# Altium project NUCLEOG431RB-Custom-IN-A2212.PrjPcb (part 3 of 3)

## Sheet Hall_Input.SchDoc
size A4
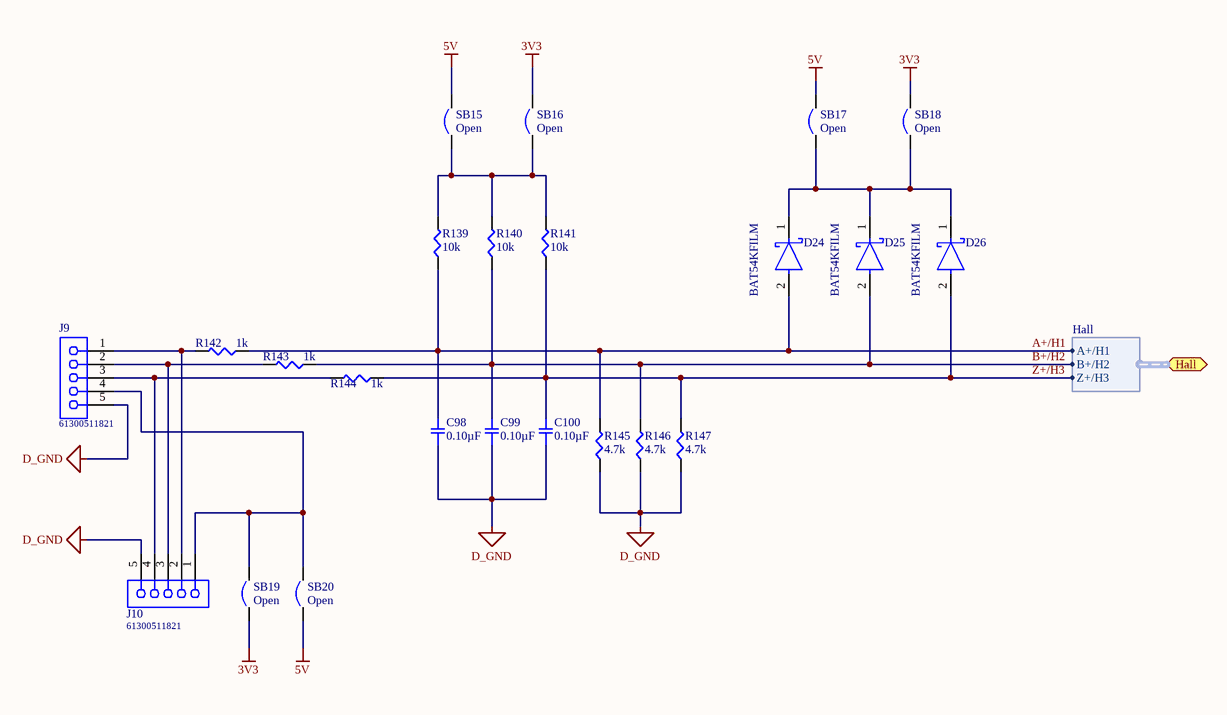
[diagram p8: Hall_Input.SchDoc]

### Parts
C98  0.10µF  [SMD-0805C]
C99  0.10µF  [SMD-0805C]
C100  0.10µF  [SMD-0805C]
D24  BAT54KFILM  [FP-SOD-523-MFG]
D25  BAT54KFILM  [FP-SOD-523-MFG]
D26  BAT54KFILM  [FP-SOD-523-MFG]
J9  61300511821  [61300511821]
J10  61300511821  [61300511821]
R139  10k  [SMD-0603-RES]
R140  10k  [SMD-0603-RES]
R141  10k  [SMD-0603-RES]
R142  1k  [SMD-0603-RES]
R143  1k  [SMD-0603-RES]
R144  1k  [SMD-0603-RES]
R145  4.7k  [SMD-0603-RES]
R146  4.7k  [SMD-0603-RES]
R147  4.7k  [SMD-0603-RES]
SB15  Open  [Solder Bridge - HP - SQ]  (no BOM)
SB16  Open  [Solder Bridge - HP - SQ]  (no BOM)
SB17  Open  [Solder Bridge - HP - SQ]  (no BOM)
SB18  Open  [Solder Bridge - HP - SQ]  (no BOM)
SB19  Open  [Solder Bridge - HP - SQ]  (no BOM)
SB20  Open  [Solder Bridge - HP - SQ]  (no BOM)

### Ports
Hall (bidir, harness Hall)

### Harnesses
Hall: A+/H1, B+/H2, Z+/H3

### Nets
3V3: SB16.2 SB18.2 SB19.1
5V: SB15.2 SB17.2 SB20.1
D_GND: C98.1 C99.1 C100.1 J9.5 J10.5 R145.1 R146.1 R147.1  [project net J2_20]
A+/H1: C98.2 D24.2(A) R139.1 R142.1 R145.2 ; port Hall.A+/H1
B+/H2: C99.2 D25.2(A) R140.1 R143.1 R146.2 ; port Hall.B+/H2
Z+/H3: C100.2 D26.2(A) R141.1 R144.1 R147.2 ; port Hall.Z+/H3
NetD24_1: D24.1(C) D25.1(C) D26.1(C) SB17.1 SB18.1
NetJ9_1: J9.1 J10.2 R142.2
NetJ9_2: J9.2 J10.3 R143.2
NetJ9_3: J9.3 J10.4 R144.2
NetJ9_4: J9.4 J10.1 SB19.2 SB20.2
NetR139_2: R139.2 R140.2 R141.2 SB15.1 SB16.1

### Library data of the parts
C98-C100 = GCD21BR71H104KA01L: CAP CER 0.1UF 50V X7R 0805; Manufacturer: Murata Electronics North America; Factory Stock: 0; Unit Price (USD): 0.24; Minimum Quantity: 1; Tolerance: ±10%; Datasheets: http://www.murata.com/~/media/webrenewal/support/library/catalog/products/capacitor/mlcc/c03e.ashx; Image: //media.digikey.com/Renders/Murata%20Renders/0805%28GxM6%29.jpg; Digi-Key Part Number: 490-11955-1-ND; Part Number: GCD21BR71H104KA01L; Quantity Available: 157; @ qty: 0; Packaging: Cut Tape (CT); Series: GCD; Part Status: Active; Value: 0.10µF; Voltage: 50V; Temperature Coefficient: X7R; Operating Temperature: -55°C ~ 125°C; Features: -; Ratings: AEC-Q200; Applications: Automotive; Mounting Type: Surface Mount, MLCC; Package / Case: 0805 (2012 Metric); Size / Dimension: 0.079" L x 0.049" W (2.00mm x 1.25mm); Height - Seated (Max): -; Thickness (Max): 0.049" (1.25mm); Lead Spacing: -; Lead Style: -
D24-D26 = CMP-12187-000026-1: DIODE SCHOTTKY 40V 300MA SOD523; Manufacturer: STMicroelectronics; Capacitance: 7pF; Value: 7pF; Max Surge Forward Current: 1.25A; Peak Reverse Current: 1uA; Max Junction Temp: +150°C; Device Class L2: Diodes; Temperature Range Low: -40°C; Category: Diode; Manufacturer Part Number: BAT54KFILM; Digikey Description: DIODE SCHOTTKY 40V 300MA SOD523; Device Class L3: Schottky Diodes; Automotive: No; Height: 0.7mm; Octopart: https://octopart.com/bat54kfilm-stmicroelectronics-39618022; ComponentLink2Description: Datasheet; Temperature Range High: +150°C; Device Class L1: Discrete Semiconductors; Max Repetitive Reverse Voltage: 40V; RoHS: TRUE; Temperature: -40°C to +150°C; ComponentLink2URL: https://www.st.com/content/ccc/resource/technical/document/datasheet/07/50/54/f2/0d/ba/4a/79/CD00001322.pdf/files/CD00001322.pdf/jcr:content/translations/en.CD00001322.pdf; Lead Free: Yes; Forward Current: 300mA; Package: SOD-523; Mouser Description: Schottky Diodes & Rectifiers schottky diode
J9 J10 = 61300511821: WR-PHD Socket Header, THT, pitch 2.54mm, Single Row, Vertical, 5pin; Pin Number: 5; Gender: Female; Rated Current: 3A; Working Voltage: 250VAC; Withstanding Voltage: 500VAC; Contact Resistance: 20mOhm; ComponentLink1Description: Manufacturer; ComponentLink1URL: http://www.we-online.de; ComponentLink2Description: Datasheet; ComponentLink2URL: https://katalog.we-online.de/em/datasheet/6130xx11821.pdf; Part Number: 61300511821; Published Date: June 2019; Publisher: Wurth Elektronik; Pitch: 2.54mm; Operating Temperature: -40 to +125degC; Mounting Technology: THT; Packaging: Tray; Row Number: Single; Orientation: Vertical
R139-R141 = ERJ-3EKF1002V: RES SMD 10K OHM 1% 1/10W 0603; Manufacturer: Panasonic Electronic Components; Factory Stock: 0; Unit Price (USD): 0.00379; @ qty: 1500; Minimum Quantity: 1; Power (Watts): 0.1W, 1/10W; Temperature Coefficient: ±100ppm/°C; Part Number: ERJ-3EKF1002V; Datasheets: http://industrial.panasonic.com/www-cgi/jvcr13pz.cgi?E+PZ+3+AOA0002+ERJ3EKF1002V+7+WW; Image: //media.digikey.com/Photos/Panasonic%20Photos/MFG_ERJ-P6W%20Series.jpg; Digi-Key Part Number: P10.0KHCT-ND; Quantity Available: 6703141; Packaging: Cut Tape (CT); Series: ERJ; Part Status: Active; Value: 10k; Tolerance: ±1%; Composition: Thick Film; Features: Automotive AEC-Q200; Operating Temperature: -55°C ~ 155°C; Package / Case: 0603 (1608 Metric); Supplier Device Package: 0603; Size / Dimension: 0.063" L x 0.031" W (1.60mm x 0.80mm); Height - Seated (Max): 0.022" (0.55mm); Number of Terminations: 2; Failure Rate: -
R142-R144 = ERJ-3EKF1001V: RES SMD 1K OHM 1% 1/10W 0603; Manufacturer: Panasonic Electronic Components; Factory Stock: 0; Unit Price (USD): 0.00379; @ qty: 1500; Minimum Quantity: 1; Power (Watts): 0.1W, 1/10W; Temperature Coefficient: ±100ppm/°C; Part Number: ERJ-3EKF1001V; Datasheets: http://industrial.panasonic.com/www-cgi/jvcr13pz.cgi?E+PZ+3+AOA0002+ERJ3EKF1001V+7+WW; Image: //media.digikey.com/Photos/Panasonic%20Photos/MFG_ERJ-P6W%20Series.jpg; Digi-Key Part Number: P1.00KHCT-ND; Quantity Available: 5218845; Packaging: Cut Tape (CT); Series: ERJ; Part Status: Active; Value: 1k; Tolerance: ±1%; Composition: Thick Film; Features: Automotive AEC-Q200; Operating Temperature: -55°C ~ 155°C; Package / Case: 0603 (1608 Metric); Supplier Device Package: 0603; Size / Dimension: 0.063" L x 0.031" W (1.60mm x 0.80mm); Height - Seated (Max): 0.022" (0.55mm); Number of Terminations: 2; Failure Rate: -
R145-R147 = ERJ-3GEYJ472V: RES SMD 4.7K OHM 5% 1/10W 0603; Manufacturer: Panasonic Electronic Components; Factory Stock: 0; Unit Price (USD): 0.00321; @ qty: 1500; Minimum Quantity: 1; Power (Watts): 0.1W, 1/10W; Temperature Coefficient: ±200ppm/°C; Part Number: ERJ-3GEYJ472V; Datasheets: http://industrial.panasonic.com/www-cgi/jvcr13pz.cgi?E+PZ+3+AOA0001+ERJ3GEYJ472V+7+WW; Image: //media.digikey.com/Photos/Panasonic%20Photos/MFG_ERJ-P6W%20Series.jpg; Digi-Key Part Number: P4.7KGCT-ND; Quantity Available: 683531; Packaging: Cut Tape (CT); Series: ERJ; Part Status: Active; Value: 4.7k; Tolerance: ±5%; Composition: Thick Film; Features: Automotive AEC-Q200; Operating Temperature: -55°C ~ 155°C; Package / Case: 0603 (1608 Metric); Supplier Device Package: 0603; Size / Dimension: 0.063" L x 0.031" W (1.60mm x 0.80mm); Height - Seated (Max): 0.022" (0.55mm); Number of Terminations: 2; Failure Rate: -
SB15-SB20 = Solder Bridge: Circuit Breaker; Published: 24-Mar-1999; Revision: July-2002: Re-released for DXP Platform.; Publisher: Altium Limited

## Sheet Thermal_Sense.SchDoc
size A4
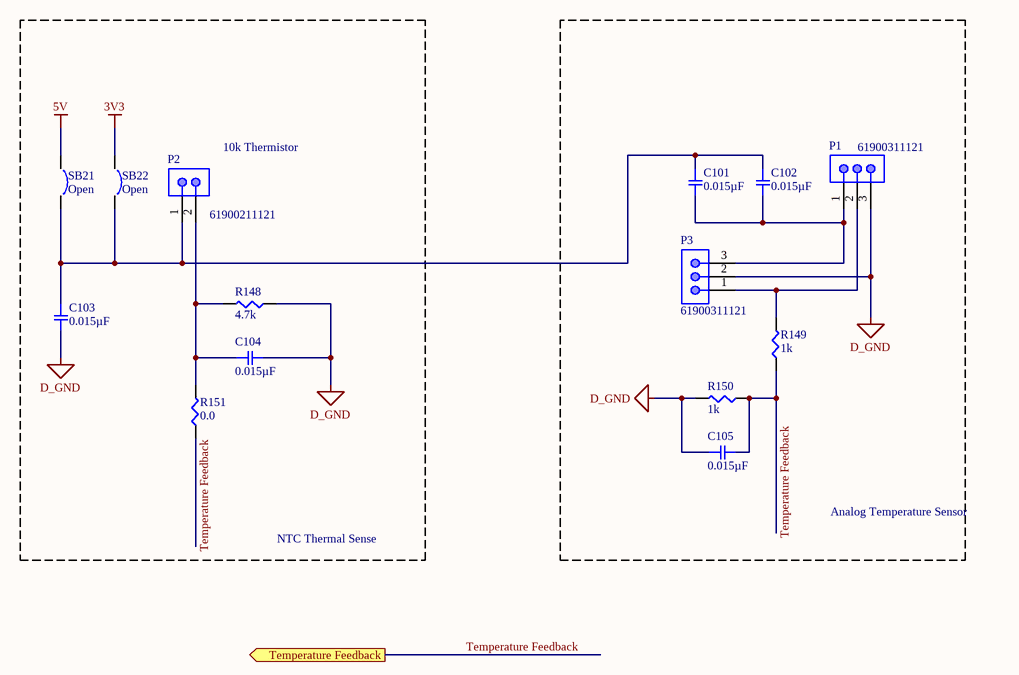
[diagram p9: Thermal_Sense.SchDoc]

### Parts
C101  0.015µF  [SMD-0805C]
C102  0.015µF  [SMD-0805C]
C103  0.015µF  [SMD-0805C]
C104  0.015µF  [SMD-0805C]
C105  0.015µF  [SMD-0805C]
P1  61900311121  [61900311121]
P2  61900211121  [61900211121]
P3  61900311121  [61900311121]
R148  4.7k  [SMD-0603-RES]
R149  1k  [SMD-0603-RES]
R150  1k  [SMD-0603-RES]
R151  0.0  [SMD-0603-RES]
SB21  Open  [Solder Bridge - HP - SQ]  (no BOM)
SB22  Open  [Solder Bridge - HP - SQ]  (no BOM)

### Blocks framed on the sheet
Analog Temperature Sensor: C101 C102 C105 P1 P3 R149 R150

### Ports
Temperature Feedback (out)

### Nets
3V3: SB22.1
5V: SB21.1
D_GND: C103.2 C104.2 C105.1 P1.3 P3.2 R148.1 R150.2  [project net J2_20]
Temperature Feedback: C105.2 R149.1 R150.1 R151.1 ; port Temperature Feedback
NetC101_1: C101.1 C102.1 C103.1 P2.1 SB21.2 SB22.2
NetC101_2: C101.2 C102.2 P1.1 P3.3
NetC104_1: C104.1 P2.2 R148.2 R151.2
NetP1_2: P1.2 P3.1 R149.2

### Notes on the sheet
- (near P2) 10k Thermistor
- NTC Thermal Sense

### Library data of the parts
C101-C105 = GC321AD72E153KX01D: CAP CER 0.015UF 250V X7T 0805; Manufacturer: Murata Electronics North America; Factory Stock: 0; Unit Price (USD): 0.27; Minimum Quantity: 1; Tolerance: ±10%; Datasheets: http://search.murata.co.jp/Ceramy/image/img/A01X/G101/ENG/GC321AD72E153KX01-01.pdf; Image: //media.digikey.com/Renders/Murata%20Renders/0805(GC3)200x125.jpg; Digi-Key Part Number: 490-13987-1-ND; Part Number: GC321AD72E153KX01D; Quantity Available: 4000; @ qty: 0; Packaging: Cut Tape (CT); Series: GC3; Part Status: Active; Value: 0.015µF; Voltage: 250V; Temperature Coefficient: X7T; Operating Temperature: -55°C ~ 125°C; Features: -; Ratings: AEC-Q200; Applications: Automotive; Mounting Type: Surface Mount, MLCC; Package / Case: 0805 (2012 Metric); Size / Dimension: 0.079" L x 0.049" W (2.00mm x 1.25mm); Height - Seated (Max): -; Thickness (Max): 0.039" (1.00mm); Lead Spacing: -; Lead Style: -
P1 P3 = 61900311121: WR-WTB THT Male Vertical Locking Header, pitch 2.54mm, 3p; Pin Number: 3; Contact Resistance: 20mOhm; Rated Current: 3A; Withstanding Voltage: 1000VAC; Working Voltage: 250VAC; ComponentLink1Description: Manufacturer; ComponentLink1URL: http://www.we-online.de; ComponentLink2Description: Datasheet; ComponentLink2URL: https://www.we-online.com/catalog/datasheet/61900311121.pdf; Pitch: 2.54mm; Published Date: January 2020; Publisher: Wurth Elektronik; Mounting Technology: THT; Packaging: Bag; Operating Temperature: -40 to +105degC; Part Number: 61900311121; Gender: Male; Type: Vertical
P2 = 61900211121: WR-WTB THT Male Vertical Locking Header, pitch 2.54mm, 2p; Pin Number: 2; Contact Resistance: 20mOhm; Rated Current: 3A; Withstanding Voltage: 1000VAC; Working Voltage: 250VAC; ComponentLink1Description: Manufacturer; ComponentLink1URL: http://www.we-online.de; ComponentLink2Description: Datasheet; ComponentLink2URL: https://www.we-online.com/catalog/datasheet/61900211121.pdf; Pitch: 2.54mm; Published Date: January 2020; Publisher: Wurth Elektronik; Mounting Technology: THT; Packaging: Bag; Operating Temperature: -40 to +105degC; Part Number: 61900211121; Gender: Male; Type: Vertical
R148 = ERJ-3EKF4701V: RES SMD 4.7K OHM 1% 1/10W 0603; Manufacturer: Panasonic Electronic Components; Factory Stock: 0; Unit Price (USD): 0.00379; @ qty: 1500; Minimum Quantity: 1; Power (Watts): 0.1W, 1/10W; Temperature Coefficient: ±100ppm/°C; Part Number: ERJ-3EKF4701V; Datasheets: http://industrial.panasonic.com/www-cgi/jvcr13pz.cgi?E+PZ+3+AOA0002+ERJ3EKF4701V+7+WW; Image: //media.digikey.com/Photos/Panasonic%20Photos/MFG_ERJ-P6W%20Series.jpg; Digi-Key Part Number: P4.70KHCT-ND; Quantity Available: 999380; Packaging: Cut Tape (CT); Series: ERJ; Part Status: Active; Value: 4.7k; Tolerance: ±1%; Composition: Thick Film; Features: Automotive AEC-Q200; Operating Temperature: -55°C ~ 155°C; Package / Case: 0603 (1608 Metric); Supplier Device Package: 0603; Size / Dimension: 0.063" L x 0.031" W (1.60mm x 0.80mm); Height - Seated (Max): 0.022" (0.55mm); Number of Terminations: 2; Failure Rate: -
R149 R150 = ERJ-3EKF1001V: as R142 on sheet Hall_Input; Part Number: ERJ-3EKF1001V; Datasheets: http://industrial.panasonic.com/www-cgi/jvcr13pz.cgi?E+PZ+3+AOA0002+ERJ3EKF1001V+7+WW; Image: //media.digikey.com/Photos/Panasonic%20Photos/MFG_ERJ-P6W%20Series.jpg; Digi-Key Part Number: P1.00KHCT-ND; Quantity Available: 5218845; Packaging: Cut Tape (CT); Series: ERJ; Part Status: Active; Value: 1k; Tolerance: ±1%; Composition: Thick Film; Features: Automotive AEC-Q200; Operating Temperature: -55°C ~ 155°C; Package / Case: 0603 (1608 Metric); Supplier Device Package: 0603; Size / Dimension: 0.063" L x 0.031" W (1.60mm x 0.80mm); Height - Seated (Max): 0.022" (0.55mm); Number of Terminations: 2; Failure Rate: -
R151 = ERJ-3GEY0R00V: RES SMD 0.0OHM JUMPER 1/10W 0603; Manufacturer: Panasonic Electronic Components; Factory Stock: 0; Unit Price (USD): 0.00352; @ qty: 1500; Minimum Quantity: 1; Power (Watts): 0.1W, 1/10W; Part Number: ERJ-3GEY0R00V; Datasheets: http://industrial.panasonic.com/www-cgi/jvcr13pz.cgi?E+PZ+3+AOA0001+ERJ3GEY0R00V+7+WW; Image: //media.digikey.com/Photos/Panasonic%20Photos/MFG_ERJ-P6W%20Series.jpg; Digi-Key Part Number: P0.0GCT-ND; Quantity Available: 4813372; Packaging: Cut Tape (CT); Series: ERJ; Part Status: Active; Value: 0.0; Tolerance: Jumper; Composition: Thick Film; Features: Automotive AEC-Q200; Temperature Coefficient: -; Operating Temperature: -55°C ~ 155°C; Package / Case: 0603 (1608 Metric); Supplier Device Package: 0603; Size / Dimension: 0.063" L x 0.031" W (1.60mm x 0.80mm); Height - Seated (Max): 0.022" (0.55mm); Number of Terminations: 2; Failure Rate: -
SB21 SB22 = Solder Bridge: Circuit Breaker; Published: 24-Mar-1999; Revision: July-2002: Re-released for DXP Platform.; Publisher: Altium Limited

## Nets that join several sheets
3.3V: Power_Section (D13.1), Analog_Sense (5 pins)
3V3: Connector (SB14.2), Hall_Input (SB16.2 SB18.2 SB19.1), Thermal_Sense (SB22.1)
5V: Isolated_Bias (7 pins), Connector (SB10.2 SB12.2 SB13.2), Hall_Input (SB15.2 SB17.2 SB20.1), Thermal_Sense (SB21.1)
15V: Auxillary_Supply (9 pins), Isolated_Bias (5 pins), Connector (SB11.2)
60V: Auxillary_Supply (7 pins), Power_Section (16 pins)
A_GND: Auxillary_Supply (23 pins), Isolated_Bias (9 pins), Power_Section (14 pins), Analog_Sense (8 pins), Current Sense (21 pins)
J2_20: Connector (12 pins), Hall_Input (8 pins), Thermal_Sense (7 pins)
A+/H1: Connector (R115.2), Hall_Input (5 pins)
B+/H2: Connector (R116.2), Hall_Input (5 pins)
BEMF_U: Analog_Sense (C16.1 D14.2 R48.1 R51.2), Connector (R124.2)
BEMF_V: Analog_Sense (C17.1 D16.2 R49.1 R52.2), Connector (R126.2 R127.2)
BEMF_W: Analog_Sense (C18.1 D18.2 R50.1 R53.2), Connector (R128.2 R129.2 R131.2)
Curr_fdbk1: Current Sense (TP39.1 U5.8 U5.9), Connector (R118.2)
Curr_fdbk2: Current Sense (TP47.1 U6.8 U6.9), Connector (R120.2)
Curr_fdbk3: Current Sense (TP55.1 U7.8 U7.9), Connector (R122.2)
GPIO_BEMF: Analog_Sense (6 pins), Connector (R121.2)
PH_U: Power_Section (7 pins), Analog_Sense (R51.1)
PH_V: Power_Section (7 pins), Analog_Sense (R52.1)
PH_W: Power_Section (7 pins), Analog_Sense (R53.1)
Temperature Feedback: Connector (R125.2), Thermal_Sense (C105.2 R149.1 R150.1 R151.1)
V_Bus: Power_Section (C13.1 D13.2 R46.2 R47.2), Connector (R123.2)
V_Shunt_U_N: Power_Section (C1.2 R43.1), Current Sense (C88.2 TP36.1 U5.10)
V_Shunt_U_P: Power_Section (C1.1 R37.1), Current Sense (C88.1 TP35.1 U5.1)
V_Shunt_V_N: Power_Section (C2.2 R44.1), Current Sense (C91.2 TP44.1 U6.10)
V_Shunt_V_P: Power_Section (C2.1 R38.1), Current Sense (C91.1 TP43.1 U6.1)
V_Shunt_W_N: Power_Section (C3.2 R45.1), Current Sense (C94.2 TP52.1 U7.10)
V_Shunt_W_P: Power_Section (C3.1 R39.1), Current Sense (C94.1 TP51.1 U7.1)
Z+/H3: Connector (R117.2), Hall_Input (5 pins)